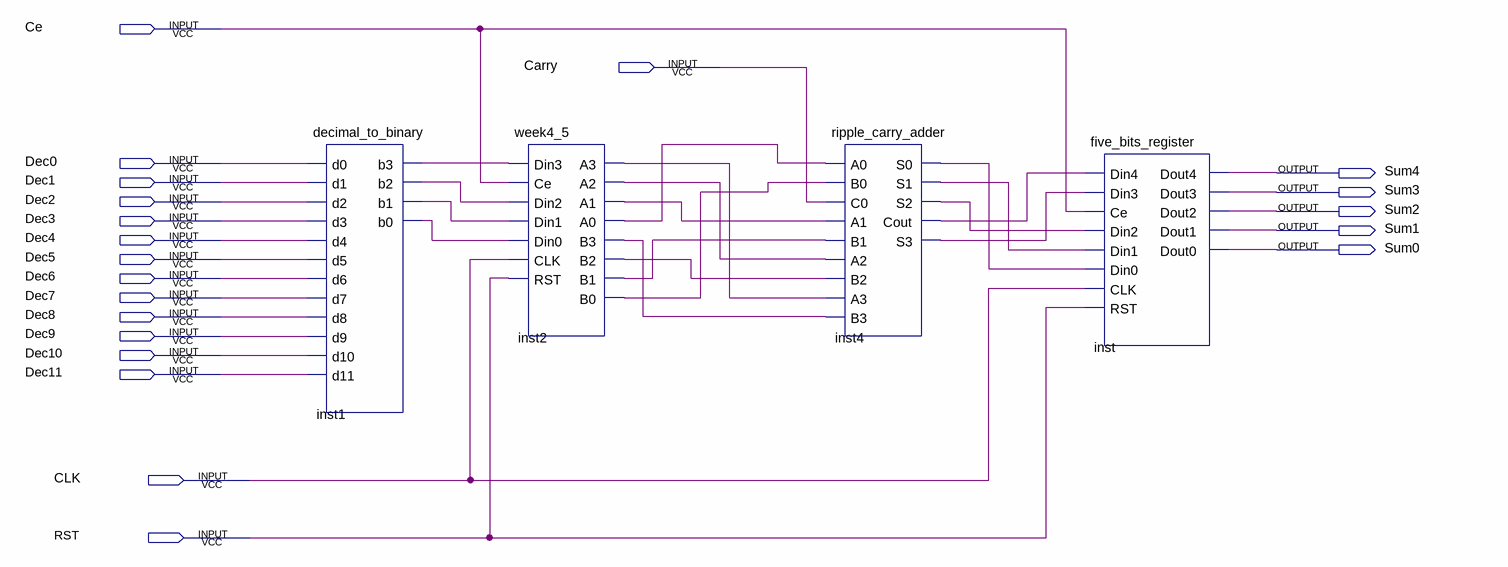
[diagram p0: schematic sheet]
// Quartus schematic week4_6.bdf as structural Verilog: 4 symbols, 21 pins
module week4_6 (
  input  Ce,
  input  Carry,
  input  Dec0,
  input  Dec1,
  input  Dec2,
  input  Dec3,
  input  Dec4,
  input  Dec5,
  input  Dec6,
  input  Dec7,
  input  Dec8,
  input  Dec9,
  input  Dec10,
  input  Dec11,
  input  CLK,
  input  RST,
  output Sum4,
  output Sum3,
  output Sum2,
  output Sum1,
  output Sum0
);

  wire inst1_b0, inst1_b1, inst1_b2, inst1_b3, inst2_a0, inst2_a1, inst2_a2, inst2_a3, inst2_b0, inst2_b1,
       inst2_b2, inst2_b3, inst4_cout, inst4_s0, inst4_s1, inst4_s2, inst4_s3;

  decimal_to_binary inst1 (
    .d0(Dec0), .d1(Dec1), .d2(Dec2), .d3(Dec3), .d4(Dec4), .d5(Dec5), .d6(Dec6), .d7(Dec7), .d8(Dec8),
    .d9(Dec9), .d10(Dec10), .d11(Dec11), .b3(inst1_b3), .b2(inst1_b2), .b1(inst1_b1), .b0(inst1_b0));
  week4_5 inst2 (
    .Din3(inst1_b3), .Ce(Ce), .Din2(inst1_b2), .Din1(inst1_b1), .Din0(inst1_b0), .CLK(CLK), .RST(RST),
    .A3(inst2_a3), .A2(inst2_a2), .A1(inst2_a1), .A0(inst2_a0), .B3(inst2_b3), .B2(inst2_b2), .B1(inst2_b1),
    .B0(inst2_b0));
  ripple_carry_adder inst4 (
    .A0(inst2_a0), .B0(inst2_b0), .C0(Carry), .A1(inst2_a1), .B1(inst2_b1), .A2(inst2_a2), .B2(inst2_b2),
    .A3(inst2_a3), .B3(inst2_b3), .S0(inst4_s0), .S1(inst4_s1), .S2(inst4_s2), .Cout(inst4_cout),
    .S3(inst4_s3));
  five_bits_register inst (
    .Din4(inst4_cout), .Din3(inst4_s3), .Ce(Ce), .Din2(inst4_s2), .Din1(inst4_s1), .Din0(inst4_s0),
    .CLK(CLK), .RST(RST), .Dout4(Sum4), .Dout3(Sum3), .Dout2(Sum2), .Dout1(Sum1), .Dout0(Sum0));
endmodule
